# EAGLE design EspressoWemos (EAGLE 7.6.0)

## Sheet 1 of 2
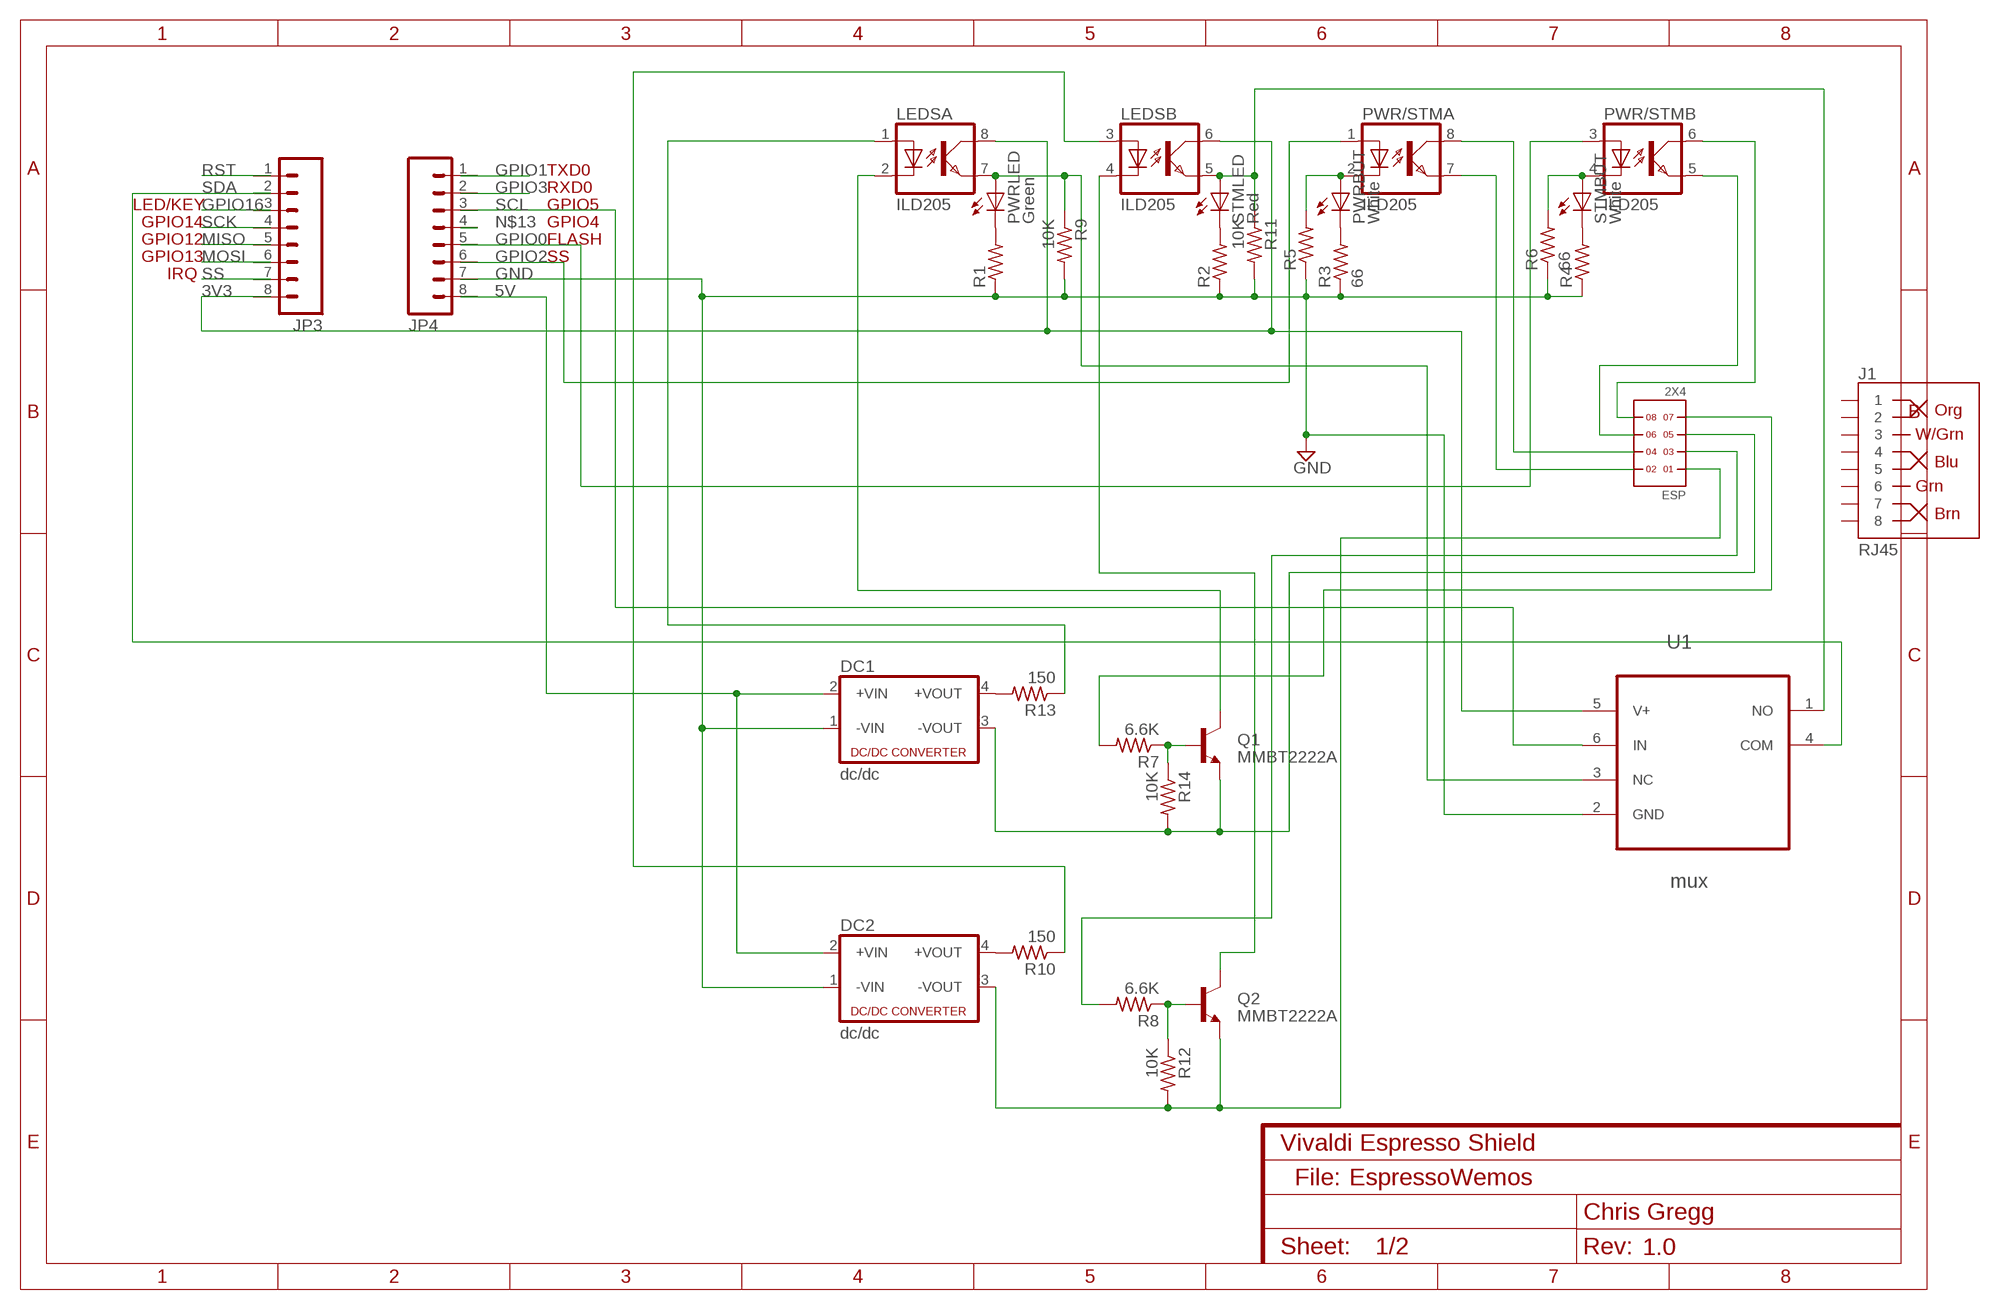
[diagram p0: schematic, sheet 1]
NAME (FRAME-A4L): CNAME: Vivaldi Espresso Shield; CREVISION: 1.0; DESIGNER: Chris Gregg

### Parts
DC1  dc/dc  VA-0505S  [4SIL]
DC2  dc/dc  VA-0505S  [4SIL]
ESP  2X4  [2X4]
J1  RJ45  RJ45-8PTH  [RJ45-8]
JP3  M08NO_SILK_FEMALE_PTH  [1X08_NO_SILK]
JP4  M08NO_SILK_FEMALE_PTH  [1X08_NO_SILK]
LEDS  ILD205  [SOIC08]
PWR/STM  ILD205  [SOIC08]
PWRBUT  White  LEDSML1206  [SML1206]
PWRLED  Green  LEDSML1206  [SML1206]
Q1  MMBT2222A  TRANSISTOR_NPNMMBT2222A  [SOT23-3]
Q2  MMBT2222A  TRANSISTOR_NPNMMBT2222A  [SOT23-3]
R1  R-US_R1206  [R1206]
R2  R-US_R1206  [R1206]
R3  66  R-US_R1206  [R1206]
R4  R-US_R1206  [R1206]
R5  R-US_R1206  [R1206]
R6  66  R-US_R1206  [R1206]
R7  6.6K  R-US_R1206  [R1206]
R8  6.6K  R-US_R1206  [R1206]
R9  10K  R-US_R1206  [R1206]
R10  150  R-US_R1206  [R1206]
R11  10K  R-US_R1206  [R1206]
R12  10K  R-US_R1206  [R1206]
R13  150  R-US_R1206  [R1206]
R14  10K  R-US_R1206  [R1206]
STMBUT  White  LEDSML1206  [SML1206]
STMLED  Red  LEDSML1206  [SML1206]
U1  mux  TS5A3159DBVR  [SOT95P280X145-6N]

### Nets
3V3: JP3.8 LEDS.6(B:COL) LEDS.8(A:COL) U1.5(V+)
5V: DC1.2(+VIN) DC2.2(+VIN) JP4.8
GND: DC1.1(-VIN) DC2.1(-VIN) JP4.7 R1.1 R2.1 R3.1 R4.1 R5.1 R6.1 R9.2 R11.2 U1.2(GND)
GPIO0: JP4.5 PWR/STM.3(B:A)
GPIO1: JP4.1
GPIO2: JP4.6 PWR/STM.1(A:A)
GPIO3: JP4.2
GPIO16: JP3.3
MISO: JP3.5
MOSI: JP3.6
N$1: PWRLED.C R1.2
N$3: R2.2 STMLED.C
N$4: ESP.2 PWR/STM.7(A:EMIT)
N$5: PWRBUT.C R3.2
N$6: ESP.6 PWR/STM.5(B:EMIT)
N$7: R4.2 STMBUT.C
N$8: ESP.4 PWR/STM.8(A:COL)
N$9: ESP.8 PWR/STM.6(B:COL)
N$10: PWR/STM.2(A:C) PWRBUT.A R5.2
N$11: PWR/STM.4(B:C) R6.2 STMBUT.A
N$12: LEDS.7(A:EMIT) PWRLED.A R9.1 U1.3(NC)
N$13: JP4.4
N$14: ESP.7 R7.2
N$15: LEDS.2(A:C) Q1.3(C)
N$16: LEDS.5(B:EMIT) R11.1 STMLED.A U1.1(NO)
N$18: ESP.3 R8.2
N$20: Q1.1(B) R7.1 R14.1
N$21: Q2.1(B) R8.1 R12.1
N$22: DC1.4(+VOUT) R13.2
N$23: DC2.4(+VOUT) R10.2
N$24: DC2.3(-VOUT) ESP.1 Q2.2(E) R12.2
N$26: LEDS.1(A:A) R13.1
N$27: LEDS.3(B:A) R10.1
N$28: DC1.3(-VOUT) ESP.5 Q1.2(E) R14.2
N$29: LEDS.4(B:C) Q2.3(C)
RST: JP3.1
SCK: JP3.4
SCL: JP4.3 U1.6(IN)
SDA: JP3.2 U1.4(COM)
SS: JP3.7
Unconnected: J1.1 J1.2 J1.3 J1.4 J1.5 J1.6 J1.7 J1.8

### Notes on the sheet
- TXD0
- RXD0
- LED/KEY | GPIO5
- GPIO14 | GPIO4
- GPIO12 | FLASH
- GPIO13 | SS
- IRQ
- File:

## Sheet 2 of 2

## Library data of the parts
DC1 DC2 = dc-dc-converter:VA-*?: DC DC Converter Single Output, 1 Watt Motien Technology Co.,Ltd. Source: Data sheet <http://www.motien.com.tw/data_sheet/VA-1%28H%29.pdf>; OC_FARNELL: unknown; OC_NEWARK: unknown
ESP = headers(2mm):2X4
J1 = SparkFun-Connectors:RJ45-8: RJ45 Jack Simple RJ45, 8-pin connection - connector for common Cat5, Cat5e, and Cat6 Ethernet cables. Footprint not yet proven in production. Connector sku is PRT-00643; Breakout PCB sku is BOB-00716.; PROD_ID: CONN-08506
JP3 JP4 = SparkFun-Connectors:M08: Header 8 Standard 8-pin 0.1" header. Use with straight break away headers (SKU : PRT-00116), right angle break away headers (PRT-00553), swiss pins (PRT-00743), machine pins (PRT-00117), and female headers (PRT-00115).; PROD_ID: CONN-08438
LEDS PWR/STM = optocoupler:ILD2*: Siemens ILD205/206/207/211/213/217 DUAL PHOTOTRANSISTOR SMALL OUTLINE SURFACE MOUNT OPTOCOUPLER Source: 153385-da-01-en-Optocoupler_ILD205-T.pdf; MF: VISHAY/TELEFUNKEN; MPN: ILD205T; OC_FARNELL: 1469512; OC_NEWARK: 20H8678
PWRBUT PWRLED STMBUT STMLED = led:LED: LED OSRAM: - CHIPLED LG R971, LG N971, LY N971, LG Q971, LY Q971, LO R971, LY R971 LH N974, LH R974 LS Q976, LO Q976, LY Q976 LO Q996 - Hyper CHIPLED LW Q18S LB Q993, LB Q99A, LB R99A - SideLED LS A670, LO A670, LY A670, LG A670, LP A670 LB A673, LV A673, LT A673, LW A673 LH A674 LY A675 LS A676, LA A676, LO A676, LY A676, LW A676 LS A679, LY A679, LG A679 - Hyper Micro SIDELED® LS Y876, LA Y876, LO Y876, LY Y876 LT Y87S - SmartLED LW L88C, LW L88S LB L89C, LB L89S, LG L890 LS L89K, LO L89K, LY L89K LS L896, LA L896, LO L896, LY L896 - TOPLED LS T670, LO T670, LY T670, LG T670, LP T670 LSG T670, LSP T670, LSY T670, LOP T670, LYG T670 LG T671, LOG T671, LSG T671 LB T673, LV T673, LT T673, LW T673 LH T674 LS T676, LA T676, LO T676, LY T676, LB T676, LH T676, LSB T676, LW T676 LB T67C, LV T67C, LT T67C, LS T67K, LO T67K, LY T67K, LW E67C LS E67B, LA E67B, LO E67B, LY E67B, LB E67C, LV E67C, LT E67C LW T67C LS T679, LY T679, LG T679 LS T770, LO T770, LY T770, LG T770, LP T770 LB T773, LV T773, LT T773, LW T773 LH T774 LS E675, LA E675, LY E675, LS T675 LS T776, LA T776, LO T776, LY T776, LB T776 LHGB T686 LT T68C, LB T68C - Hyper Mini TOPLED® LB M676 - Mini TOPLED Santana® LG M470 LS M47K, LO M47K, LY M47K Source: http://www.osram.convergy.de LUXEON: - LUMILED® LXK2-PW12-R00, LXK2-PW12-S00, LXK2-PW14-U00, LXK2-PW14-V00 LXK2-PM12-R00, LXK2-PM12-S00, LXK2-PM14-U00 LXK2-PE12-Q00, LXK2-PE12-R00, LXK2-PE12-S00, LXK2-PE14-T00, LXK2-PE14-U00 LXK2-PB12-K00, LXK2-PB12-L00, LXK2-PB12-M00, LXK2-PB14-N00, LXK2-PB14-P00, LXK2-PB14-Q00 LXK2-PR12-L00, LXK2-PR12-M00, LXK2-PR14-Q00, LXK2-PR14-R00 LXK2-PD12-Q00, LXK2-PD12-R00, LXK2-PD12-S00 LXK2-PH12-R00, LXK2-PH12-S00 LXK2-PL12-P00, LXK2-PL12-Q00, LXK2-PL12-R00 Source: www.luxeon.com KINGBRIGHT: KA-3528ASYC Source: www.kingbright.com
Q1 Q2 = SparkFun-DiscreteSemi:TRANSISTOR_NPN: Generic NPN BJT MMBT2222A - TRANS-08049 (SOT-23, 1A 40V) MPSA42 - TRANS-09116 (SOT-23, 500mA 300V) MMBT5088LT1G - TRANS-11160 (SOT-23, 50 mA 30V) BC547 - COM-08928 <http://www.sparkfun.com/products/8928> (TO-92 45V 100mA) (1.Collector 2.Base 3.Emitter) 2N3904 - COM-00521 <http://www.sparkfun.com/products/521> (TO-92 40V 200mA) (1.Emitter 2.Base 3.Collector) P2N2222A - COM-12852 <http://www.sparkfun.com/products/12852> (TO-92 40V 600mA) (1.Collector 2.Base 3.Emitter); PROD_ID: TRANS-08049
R1-R14 = rcl:R-US_: RESISTOR, American symbol
U1 = Texas Instruments_By_element14_Batch_1:TS5A3159DBVR: 1 ohm SPDT Analog Switch; MPN: TS5A3159DBVR; OC_FARNELL: 1053238; OC_NEWARK: 98K1871; PACKAGE: SOT-23-6; SUPPLIER: Texas Instruments

## Net classes
0 default: width 0.203 mm, drill 0.356 mm, clearance 0.152 mm

## Board
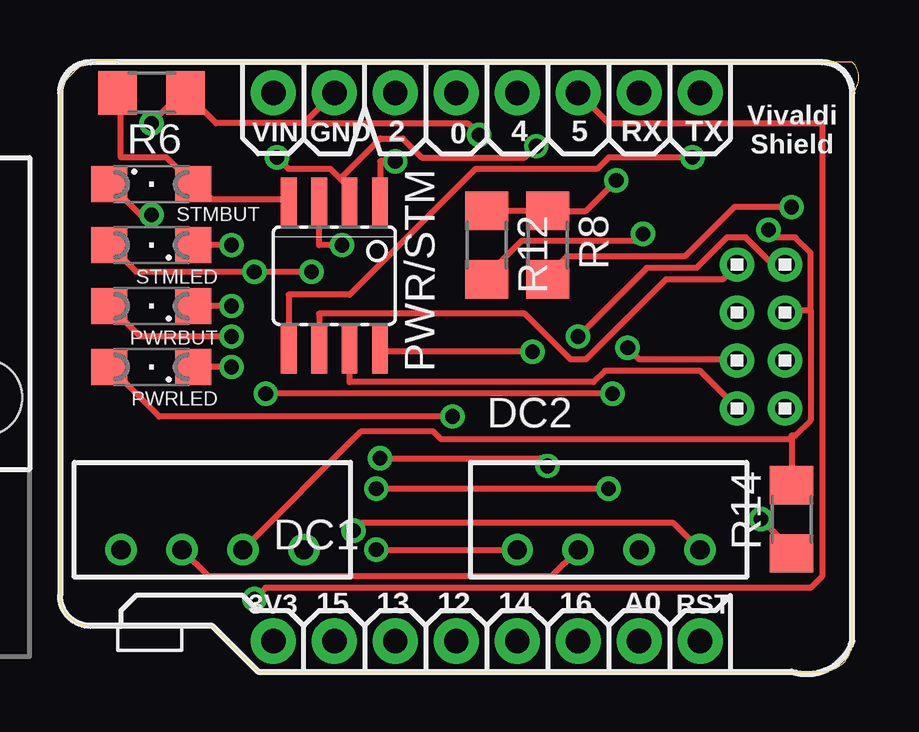
[diagram p1: board, top side]
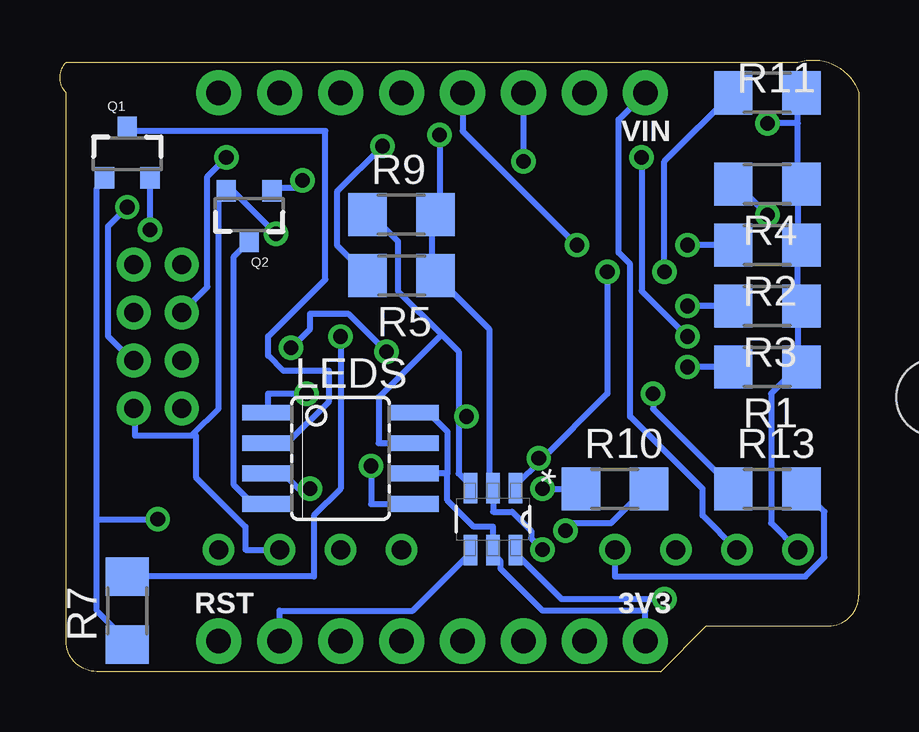
[diagram p2: board, bottom side, seen from below]

Size 33.28 x 25.5 mm. Coordinates in mm from the lower left corner, seen from the top.
Outline: 33.02,25.4 2.54,25.4 arc90 0,24.13 0,3.17 arc90 1.27,1.91 6.35,1.91 8.25,0 31.75,0 arc90 33.02,1.27 33.02,24.13 arc90 33.02,25.4
Copper layers (1*16): Top 0.035mm / dielectric 1.5mm / Bottom 0.035mm
Design rules "default": minimum track width 10mil, minimum drill 24mil, track to track 8mil, track to pad 8mil, pad to pad 8mil, via to via 8mil, smd to smd 8mil, copper to edge 40mil, drill to drill 8mil, minimum pad ring 10mil, minimum via ring 8mil, stop-mask expansion 4mil, vias tented up to drill 0mil, thermal gap 10mil

### Footprints (pad centres in the part's own frame; a part is rotated, then mirrored left to right if it is on the bottom)
4SIL = drill 0.8: 1 -3.81,0; 2 -1.27,0; 3 1.27,0; 4 3.81,0
2X4 = drill 0.8 pad 1.422: 1 -3,-1; 2 -3,1; 3 -1,-1; 4 -1,1; 5 1,-1; 6 1,1; 7 3,-1; 8 3,1
RJ45-8 = drill 1 pad 1.88 square: 1 -4.445,6.35 | drill 1 pad 1.88: 2 -3.175,8.89; 3 -1.905,6.35; 4 -0.635,8.89; 5 0.635,6.35; 6 1.905,8.89; 7 3.175,6.35; 8 4.445,8.89 | hole 3.2: -5.715,0; 5.715,0
1X08_NO_SILK = drill 1.016 pad 1.88: 1 0,0; 2 2.54,0; 3 5.08,0; 4 7.62,0; 5 10.16,0; 6 12.7,0; 7 15.24,0; 8 17.78,0
SOIC08 = smd 0.66 x 2.032: 1 -1.905,-3.073; 2 -0.635,-3.073; 3 0.635,-3.073; 4 1.905,-3.073; 5 1.905,3.073; 6 0.635,3.073; 7 -0.635,3.073; 8 -1.905,3.073
SML1206 = smd 1.5 x 1.5: A 1.75,0; C -1.75,0
SOT23-3 = smd 0.8 x 0.9: 1 -0.95,-1; 2 0.95,-1; 3 0,1.1
R1206 = smd 1.6 x 1.803: 1 -1.422,0; 2 1.422,0
SOT95P280X145-6N = smd 1.27 x 0.559: 1 -1.295,0.94; 2 -1.295,0; 3 -1.295,-0.94; 4 1.295,-0.94; 5 1.295,0; 6 1.295,0.94

### Placement (x,y rotation side)
DC1  6.35,5.08 0 top
DC2  22.86,5.08 0 top
ESP  29.21,13.97 90 top
J1  -8.89,11.43 0 top  (outside the outline)
JP3  26.67,1.27 180 top
JP4  26.67,24.13 180 top
LEDS  21.59,8.89 270 bottom
PWR/STM  11.43,16.51 180 top
PWRBUT  3.81,15.24 180 top
PWRLED  3.81,12.7 180 top
Q1  30.48,21.59 0 bottom
Q2  25.4,19.05 180 bottom
R1  3.81,12.7 180 bottom
R2  3.81,17.78 180 bottom
R3  3.81,15.24 180 bottom
R4  3.81,20.32 180 bottom
R5  19.05,16.51 180 bottom
R6  3.81,24.13 180 top
R7  30.48,2.54 90 bottom
R8  20.32,17.78 270 top
R9  19.05,19.05 0 bottom
R10  10.16,7.62 0 bottom
R11  3.81,24.13 0 bottom
R12  17.78,17.78 270 top
R13  3.81,7.62 0 bottom
R14  30.48,6.35 90 top
STMBUT  3.81,20.32 0 top
STMLED  3.81,17.78 180 top
U1  15.24,6.35 270 bottom

### Tracks (layer width: path | path; a pad name or v marks a point on that pad's centre or on a via)
3V3
  Bottom 0.254: 17.14,8.26 LEDS.6 | 17.14,8.26 17.14,10 17.94,10.8 LEDS.8 | JP3.8 8.89,2.54 13.18,2.54 14.92,4.29 14.92,4.6 15.24,4.92 U1.5 15.24,6.03 16.03,6.03 17.14,7.14 17.14,8.26
5V
  Top 0.254: DC1.2 6.19,3.97 20.48,3.97 DC2.2
  Bottom 0.254: JP4.8 10,23.02 10,17.46 9.52,16.99 9.52,10.64 6.51,7.62 6.51,6.51 DC1.2
GND  (via drill 0.61)
  Top 0.254: v13.18,5.08 DC2.1 | JP4.7 10.24,22.94 | 10.24,22.94 10.16,22.86 6.51,22.86 R6.1 5.08,24.13 v3.81,22.86 | v17.46,22.38 16.99,22.86 10.32,22.86 10.24,22.94
  Bottom 0.254: v13.18,5.08 13.65,5.56 13.65,5.87 14.45,6.67 15.24,6.67 U1.2 15.24,7.78 15.4,7.94 15.4,14.29 R5.1 17.78,16.51 17.78,19.05 R9.2 17.46,19.21 v17.46,22.38 | 2.54,20.32 2.54,17.78 | 2.54,20.32 2.54,22.86 | 2.54,22.86 2.54,24.13 R11.2 | 2.54,20.32 R4.1 | 2.54,15.24 2.54,12.7 | DC1.1 3.65,6.19 3.65,11.59 2.54,12.7 | 2.54,12.7 R1.1 | 2.54,15.24 2.54,17.78 | 2.54,17.78 R2.1 | 2.54,15.24 R3.1 | 2.54,22.86 v3.81,22.86
GPIO0  (via drill 0.61)
  Top 0.254: PWR/STM.3 10.79,17.78 v11.75,17.78
  Bottom 0.254: v11.75,17.78 16.51,22.54 JP4.5
GPIO2  (via drill 0.61)
  Top 0.254: PWR/STM.1 13.34,21.27 v13.97,21.27
  Bottom 0.254: JP4.6 v13.97,21.27
N$1  (via drill 0.61)
  Top 0.254: v7.14,12.7 PWRLED.C
  Bottom 0.254: R1.2 v7.14,12.7
N$3  (via drill 0.61)
  Top 0.254: v7.14,17.78 STMLED.C
  Bottom 0.254: R2.2 v7.14,17.78
N$4
  Top 0.254: PWR/STM.7 12.06,12.07 22.22,12.07 22.7,12.54 26.67,12.54 28.1,11.11 ESP.2
N$5  (via drill 0.61)
  Top 0.254: v7.14,15.24 PWRBUT.C
  Bottom 0.254: R3.2 v7.14,15.24
N$6  (via drill 0.61)
  Top 0.254: PWR/STM.5 9.52,15.72 12.06,15.72 17.3,20.96 22.38,20.96 22.86,21.43 v26.35,21.43
  Bottom 0.254: v26.35,21.43 27.15,20.64 27.15,16.03 ESP.6
N$7  (via drill 0.61)
  Top 0.254: v3.81,19.05 3.33,19.05 STMBUT.C
  Bottom 0.254: v3.81,19.05 5.08,20.32 R4.2
N$8  (via drill 0.61)
  Top 0.254: v19.68,13.34 13.34,13.34 PWR/STM.8 | v23.65,13.49 24.13,13.02 28.1,13.02 ESP.4
  Bottom 0.254: v19.68,13.34 21.27,14.92 22.86,14.92 22.86,14.29 v23.65,13.49
N$9
  Top 0.254: PWR/STM.6 10.79,14.92 19.37,14.92 21.27,13.02 21.91,13.02 25.24,16.35 27.62,16.35 28.1,16.83 ESP.8
N$10  (via drill 0.61)
  Top 0.254: v7.14,13.97 3.33,13.97 PWRBUT.A | v9.05,21.43 9.52,20.96 11.27,20.96 11.67,20.56 | 11.67,20.56 12.06,20.16 PWR/STM.2 | v19.84,21.91 19.37,21.43 15.08,21.43 14.29,22.23 13.34,22.23 11.67,20.56
  Bottom 0.254: v7.14,13.97 9.05,15.87 v9.05,21.43 | v19.84,21.91 21.75,20 21.75,17.78 R5.2
N$11
  Top 0.254: PWR/STM.4 9.52,19.68 6.35,19.68 5.71,20.32 STMBUT.A 4.45,21.43 2.54,21.43 2.54,24.13 R6.2
N$12  (via drill 0.61)
  Top 0.254: v16.35,10.64 4.13,10.64 PWRLED.A
  Bottom 0.254: 16.67,10.64 16.67,13.34 17.38,14.05 | 16.67,10.64 16.67,8.26 16.19,7.78 U1.3 | 17.38,14.05 19.21,15.87 19.21,17.94 20.32,19.05 R9.1 | 16.67,10.64 v16.35,10.64 | LEDS.7 20,9.52 20,11.43 17.38,14.05
N$14  (via drill 0.61)
  Top 0.254: v21.59,13.97 24.45,16.83 26.51,16.83 27.78,18.1 28.58,18.1 29.69,16.99 30.16,16.99 ESP.7
  Bottom 0.254: v21.59,13.97 21.59,7.62 22.7,6.51 22.7,3.97 R7.2
N$15
  Bottom 0.254: LEDS.2 23.81,9.52 22.07,11.27 22.07,12.54 23.97,12.54 24.61,13.18 24.61,13.97 22.22,16.35 22.22,22.54 30.48,22.54 Q1.3
N$16  (via drill 0.61)
  Top 0.254: v10.48,16.67 v8.1,16.67 3.17,16.67 STMLED.A | v20.32,8.57 20,8.89 v13.34,8.89
  Bottom 0.254: 13.26,8.81 10.48,11.59 v10.48,16.67 | 13.26,8.81 14.29,7.78 U1.1 | v8.1,16.67 8.1,21.27 R11.1 | LEDS.5 20.32,6.98 v20.32,8.57 | v13.34,8.89 13.26,8.81
N$18  (via drill 0.61)
  Top 0.254: v30.48,19.37 28.1,19.37 26.03,17.3 21.11,17.3 20.32,16.51 R8.2
  Bottom 0.254: v30.48,19.37 31.27,18.57 31.27,13.97 30.32,13.02 ESP.3
N$20  (via drill 0.61)
  Top 0.254: v29.21,6.35 30.48,5.08 R14.1
  Bottom 0.254: 31.75,6.35 31.75,2.54 30.48,1.27 R7.1 | 31.75,6.35 31.75,20.16 31.43,20.48 Q1.1 | 31.75,6.35 v29.21,6.35
N$21  (via drill 0.61)
  Top 0.254: v23.18,20.48 21.91,19.21 R8.1 | R8.1 R12.1 | R8.1
  Bottom 0.254: v23.18,20.48 23.18,20.16 24.45,20.16 Q2.1
N$22
  Bottom 0.254: DC1.4 10.16,3.97 2.22,3.97 1.43,4.76 1.43,6.67 R13.2
N$23  (via drill 0.61)
  Top 0.254: v12.22,5.87 12.54,6.19 25.56,6.19 DC2.4
  Bottom 0.254: v12.22,5.87 12.22,6.19 10.32,6.19 8.89,7.62 R10.2
N$24  (via drill 0.61)
  Top 0.254: v24.29,18.26 23.97,17.94 19.21,17.94 17.78,16.51 R12.2
  Bottom 0.254: 27.7,9.92 27.78,9.84 30.16,9.84 30.16,10.95 ESP.1 | 27.7,9.92 26.67,10.95 26.67,19.68 26.35,20 Q2.2 26.19,20.16 v24.29,18.26 | DC2.3 25.56,5.08 25.56,6.03 27.62,8.1 27.62,9.84 27.7,9.92
N$26  (via drill 0.61)
  Top 0.254: v23.02,11.59 v8.57,11.59
  Bottom 0.254: v8.57,11.59 8.57,10.95 R13.1 | v23.02,11.59 24.61,11.59 24.61,10.8 LEDS.1
N$27  (via drill 0.61)
  Top 0.254: v22.86,7.62 v13.18,7.62
  Bottom 0.254: v13.18,7.62 R10.1 | v22.86,7.62 23.34,7.62 23.97,8.26 LEDS.3
N$28  (via drill 0.61)
  Top 0.254: v29.53,18.41 29.84,18.1 30.64,18.1 31.27,17.46 31.27,15.08 | 31.27,15.08 30.32,15.08 ESP.5 | 30.48,9.68 30.48,9.84 30.64,9.84 31.27,10.48 31.27,15.08 | 30.48,9.68 R14.2 | DC1.3 12.54,10 15.56,10 15.88,9.68 30.48,9.68
  Bottom 0.254: v29.53,18.41 29.53,20.48 Q1.2
N$29
  Bottom 0.254: LEDS.4 25.24,6.98 26.03,7.78 26.03,17.3 Q2.3
SCL  (via drill 0.61)
  Top 0.254: v8.1,3.02 8.57,3.49 31.27,3.49 31.75,3.97 31.75,22.86 22.86,22.86 JP4.3
  Bottom 0.254: v8.1,3.02 12.38,3.02 14.29,4.92 U1.6
SDA
  Bottom 0.254: JP3.2 24.13,2.54 18.57,2.54 16.19,4.92 U1.4

### Text on the board
tNames: Vivaldi / Shield | VIN | GND | 2 | 0 | 4 | 5 | RX | TX | 3V3 | 15 | 13 | 12 | 14 | 16 | A0 | RST
bNames: VIN | 3V3 | RST